# EAGLE design covox (EAGLE 7.5.0)
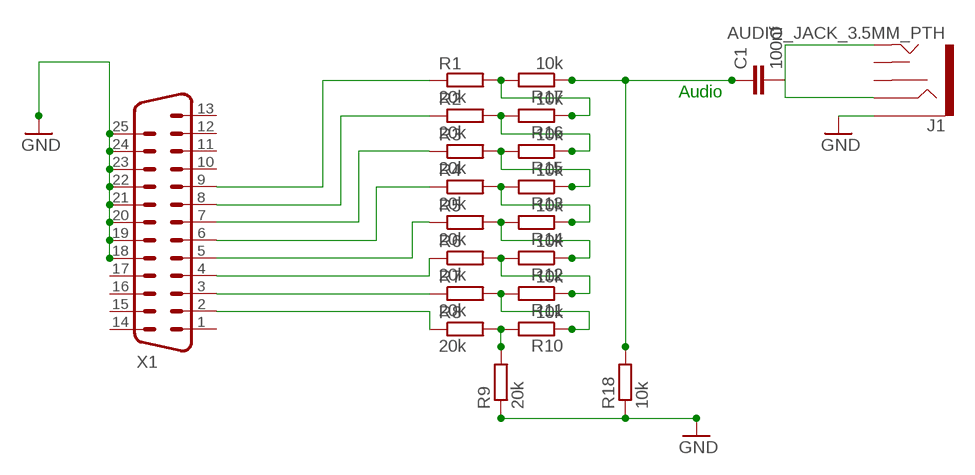
[diagram p0: schematic, sheet 1]

## Parts
C1  100nf  C2.5/2  [C2.5-2]
J1  AUDIO_JACK_3.5MM_PTH  [AUDIO-JACK]
R1  20k  R-EU_0204/7  [0204/7]
R2  20k  R-EU_0204/7  [0204/7]
R3  20k  R-EU_0204/7  [0204/7]
R4  20k  R-EU_0204/7  [0204/7]
R5  20k  R-EU_0204/7  [0204/7]
R6  20k  R-EU_0204/7  [0204/7]
R7  20k  R-EU_0204/7  [0204/7]
R8  20k  R-EU_0204/7  [0204/7]
R9  20k  R-EU_0204/7  [0204/7]
R10  10k  R-EU_0204/7  [0204/7]
R11  10k  R-EU_0204/7  [0204/7]
R12  10k  R-EU_0204/7  [0204/7]
R13  10k  R-EU_0204/7  [0204/7]
R14  10k  R-EU_0204/7  [0204/7]
R15  10k  R-EU_0204/7  [0204/7]
R16  10k  R-EU_0204/7  [0204/7]
R17  10k  R-EU_0204/7  [0204/7]
R18  10k  R-EU_0204/7  [0204/7]
X1  M25HP  [M25HP]

## Nets
GND: J1.SLEEVE R9.1 R18.1 X1.18 X1.19 X1.20 X1.21 X1.22 X1.23 X1.24 X1.25
N$1: R8.2 R9.2 R10.2
N$2: R7.2 R10.1 R11.2
N$3: R6.2 R11.1 R12.2
N$4: R4.2 R13.2 R14.1
N$5: C1.2 J1.RING J1.TIP
N$6: R3.2 R13.1 R15.2
N$7: R2.2 R15.1 R16.2
N$8: R1.2 R16.1 R17.2
N$9: R8.1 X1.2
N$10: R7.1 X1.3
N$11: C1.1 R17.1 R18.2
N$12: R6.1 X1.4
N$13: R5.1 X1.5
N$14: R4.1 X1.6
N$15: R3.1 X1.7
N$16: R2.1 X1.8
N$17: R5.2 R12.1 R14.2
N$18: R1.1 X1.9
Unconnected: J1.RSH J1.TSH X1.1 X1.10 X1.11 X1.12 X1.13 X1.14 X1.15 X1.16 X1.17

## Notes on the sheet
- Audio

## Library data of the parts
C1 = capacitor-wima:C: CAPACITOR naming: grid - package width
J1 = SparkFun-Connectors:AUDIO_JACK_3.5MM: Audio Jack 3.5mm variants of PTH and SMT stereo audio jack with bypass switches. SparkFun Products: SparkFun SparkPunk Sound Kit <[https://www.sparkfun.com/products/11177]> - PTH MP3 Trigger <https://www.sparkfun.com/products/13720> -3.5mm SMD SparkFun PicoBoard <https://www.sparkfun.com/products/11888>- 2.5mm SMD; PROD_ID: CONN-08774; SF_ID: PRT-08032
R1-R18 = rcl:R-EU_: RESISTOR, European symbol
X1 = con-subd:M25: SUB-D; OC_FARNELL: unknown; OC_NEWARK: unknown

## Board
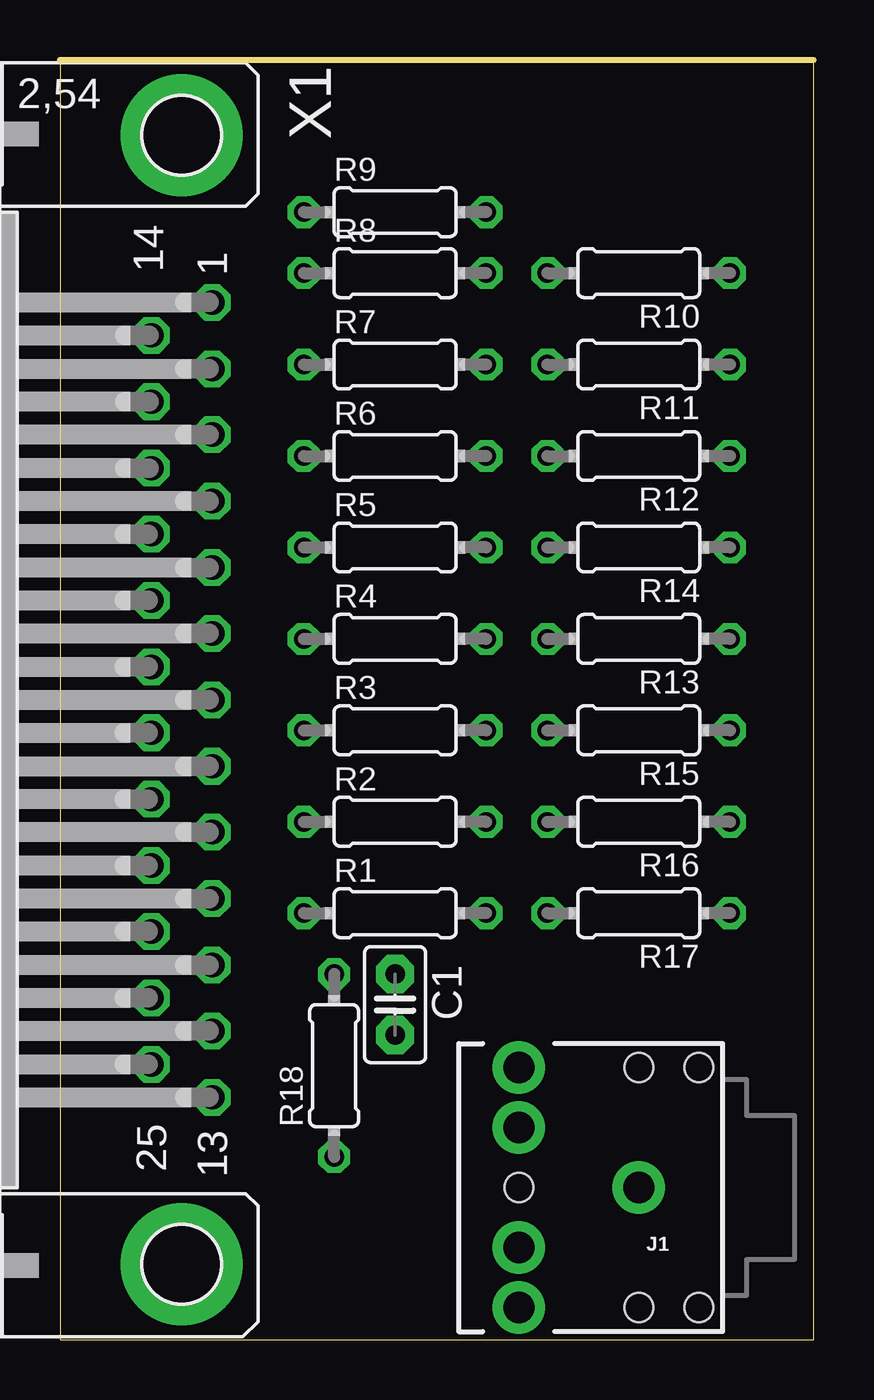
[diagram p1: board, top side]
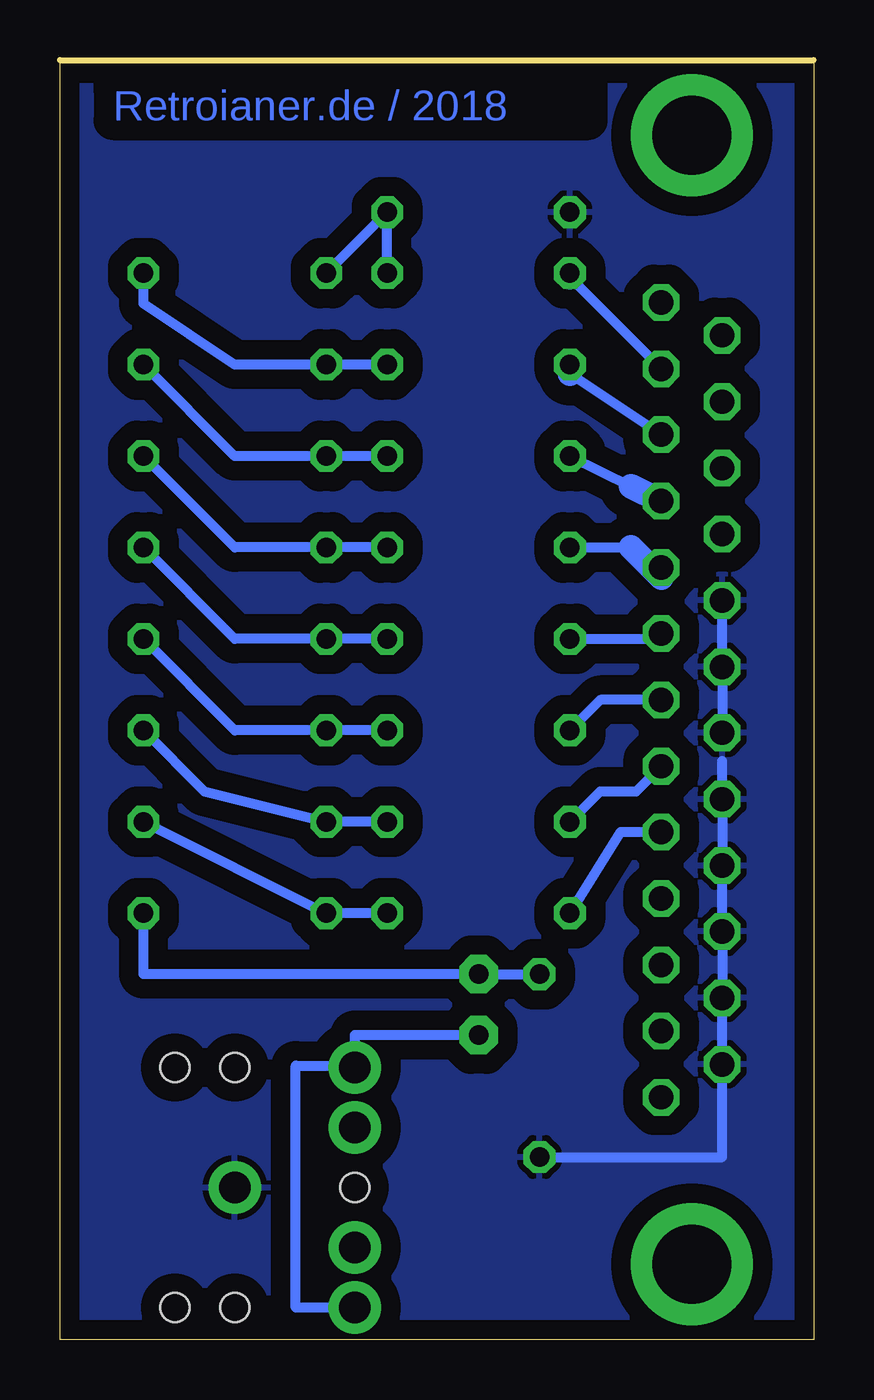
[diagram p2: board, bottom side, seen from below]

Size 31.42 x 53.33 mm. Coordinates in mm from the lower left corner, seen from the top.
Outline: 0,0 31.42,0 31.42,53.33 0,53.33 0,0
Copper layers (1*16): Top 0.035mm / dielectric 1.5mm / Bottom 0.035mm
Design rules "dirt_cheap_dirty_boards.v1.1": minimum track width 6mil, minimum drill 12mil, track to track 6mil, track to pad 6mil, pad to pad 6mil, via to via 6mil, smd to smd 0mil, copper to edge 10mil, drill to drill 10mil, minimum pad ring 10mil, minimum via ring 6mil, stop-mask expansion 2mil, vias tented up to drill 25mil, thermal gap 10mil

### Footprints (pad centres in the part's own frame; a part is rotated, then mirrored left to right if it is on the bottom)
C2.5-2 = drill 0.813 pad 1.6 octagon: 1 -1.27,0; 2 1.27,0
AUDIO-JACK = drill 1.3 pad 2.184: RING 5,5; RSH 5,2.5; SLEEVE 0,0; TIP 5,-5; TSH 5,-2.5 | hole 1.2: 0,5; -2.5,5; -2.5,-5; 0,-5; 5,0
0204/7 = drill 0.813 octagon: 1 -3.81,0; 2 3.81,0
M25HP = drill 1.016 octagon: 1 -16.561,1.27; 2 -13.792,1.27; 3 -11.049,1.27; 4 -8.28,1.27; 5 -5.512,1.27; 6 -2.769,1.27; 7 0,1.27; 8 2.769,1.27; 9 5.512,1.27; 10 8.28,1.27; 11 11.049,1.27; 12 13.792,1.27; 13 16.561,1.27; 14 -15.189,-1.27; 15 -12.421,-1.27; 16 -9.652,-1.27; 17 -6.909,-1.27; 18 -4.14,-1.27; 19 -1.372,-1.27; 20 1.372,-1.27; 21 4.14,-1.27; 22 6.909,-1.27; 23 9.652,-1.27; 24 12.421,-1.27; 25 15.189,-1.27 | drill 3.302 pad 5.08: G1 -23.52,0; G2 23.52,0

### Placement (x,y rotation side)
C1  13.97,13.97 270 top
J1  24.13,6.35 180 top
R1  13.97,17.78 0 top
R2  13.97,21.59 0 top
R3  13.97,25.4 0 top
R4  13.97,29.21 0 top
R5  13.97,33.02 0 top
R6  13.97,36.83 0 top
R7  13.97,40.64 0 top
R8  13.97,44.45 0 top
R9  13.97,46.99 0 top
R10  24.13,44.45 180 top
R11  24.13,40.64 180 top
R12  24.13,36.83 180 top
R13  24.13,29.21 180 top
R14  24.13,33.02 180 top
R15  24.13,25.4 180 top
R16  24.13,21.59 180 top
R17  24.13,17.78 180 top
R18  11.43,11.43 90 top
X1  5.08,26.67 270 top

### Tracks (layer width: path | path; a pad name or v marks a point on that pad's centre or on a via)
GND
  Bottom 0.406: 3.81,24.13 X1.21 X1.22 X1.23 X1.24 X1.25 3.81,7.62 R18.1 | X1.20 X1.19 X1.18
  pour Bottom (isolate 0.813): 0,53.34 0,0 30.48,0 30.48,53.34
N$1
  Bottom 0.406: R8.2 R9.2 R10.2
N$2
  Bottom 0.406: R7.2 R11.2 24.13,40.64 27.94,43.18 R10.1
N$3
  Bottom 0.406: R11.1 24.13,36.83 R12.2 R6.2
N$4
  Bottom 0.406: R14.1 24.13,29.21 R13.2 R4.2
N$5
  Bottom 0.406: C1.2 19.13,12.7 J1.TIP 19.13,11.43 21.59,11.43 21.59,1.35 J1.RING
N$6
  Bottom 0.406: R13.1 24.13,25.4 R15.2 R3.2
N$7
  Bottom 0.406: R15.1 25.4,22.86 R16.2 R2.2
N$8
  Bottom 0.406: R16.1 R17.2 R1.2
N$9
  Bottom 0.406: X1.2 10.16,44.27
  Bottom 1.016: 10.16,44.27 R8.1
N$10
  Bottom 0.406: X1.3 10.16,40.26
  Bottom 1.016: 10.16,40.26 R7.1
N$11
  Bottom 0.406: R17.1 27.94,15.24 C1.1 R18.2
N$12
  Bottom 0.406: R6.1 7.62,35.56
  Bottom 1.016: 7.62,35.56 X1.4
N$13
  Bottom 0.406: R5.1 7.62,33.02 | 6.35,31.75 X1.5
  Bottom 1.016: 7.62,33.02 6.35,31.75
N$14
  Bottom 0.406: R4.1 6.35,29.21 X1.6
N$15
  Bottom 0.406: X1.7 8.89,26.67 R3.1
N$16
  Bottom 0.406: R2.1 8.89,22.86 7.39,22.86 X1.8
N$17
  Bottom 0.406: R12.1 24.13,33.02 R14.2 R5.2
N$18
  Bottom 0.406: X1.9 8.05,21.16 R1.1

### Text on the board
Bottom: Retroianer.de / 2018